# Altium schematic sheet EE3102_Project_2.SchDoc
size A; SheetNumber: 2; SheetTotal: 2
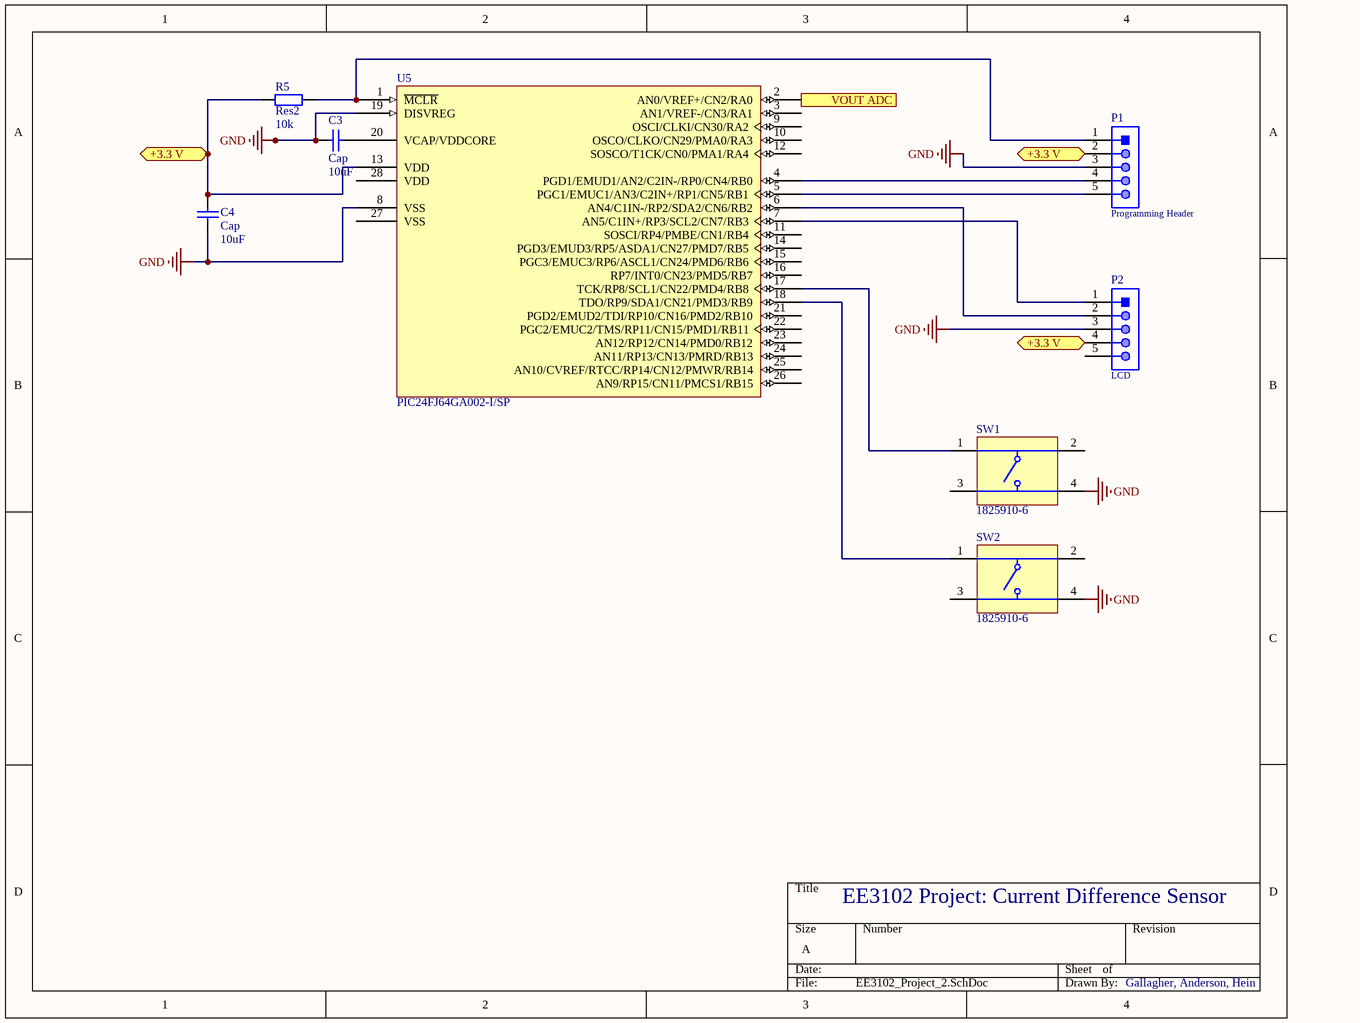
[diagram p0: EE3102_Project_2.SchDoc]

## Parts
C3  Cap  value 10uF  [RAD-0.3]
C4  Cap  value 10uF  [RAD-0.3]
P1  Programming Header  [61300511121]
P2  LCD  [LCD_5_Pin]
R5  Res2  value 10k  [AXIAL-0.4]
SW1  1825910-6  [TECO-1825910-6_V]
SW2  1825910-6  [TECO-1825910-6_V]
U5  PIC24FJ64GA002-I/SP  [SPDIP300-SP28]

## Ports
+3.3 V (bidir), VOUT ADC

## Nets
GND: C3.2 C4.2 P1.3(VSS) P2.3(GND) SW1.4 SW2.4 U5.8(VSS) U5.19(DISVREG)
+3.3 V: C4.1 P1.2(VDD) P2.4(SDA) R5.2 U5.13(VDD) ; port +3.3 V
VOUT ADC: U5.2(AN0/VREF+/CN2/RA0) ; port VOUT ADC
NetC3_1: C3.1 U5.20(VCAP/VDDCORE)
NetP1_1: P1.1(nmclr) R5.1 U5.1(~{MCLR})
NetP1_4: P1.4(PGD) U5.4(PGD1/EMUD1/AN2/C2IN-/RP0/CN4/RB0)
NetP1_5: P1.5(PGC) U5.5(PGC1/EMUC1/AN3/C2IN+/RP1/CN5/RB1)
NetP2_1: P2.1(XRST) U5.7(AN5/C1IN+/RP3/SCL2/CN7/RB3)
NetP2_2: P2.2(VDD) U5.6(AN4/C1IN-/RP2/SDA2/CN6/RB2)
NetSW1_1: SW1.1 U5.17(TCK/RP8/SCL1/CN22/PMD4/RB8)
NetSW2_1: SW2.1 U5.18(TDO/RP9/SDA1/CN21/PMD3/RB9)

Not connected (* = marked no-connect by the designer): P2 5(SCL); SW1 2 3; SW2 2 3; U5 3(AN1/VREF-/CN3/RA1) 9(OSCI/CLKI/CN30/RA2) 10(OSCO/CLKO/CN29/PMA0/RA3) 11(SOSCI/RP4/PMBE/CN1/RB4) 12(SOSCO/T1CK/CN0/PMA1/RA4) 14(PGD3/EMUD3/RP5/ASDA1/CN27/PMD7/RB5) 15(PGC3/EMUC3/RP6/ASCL1/CN24/PMD6/RB6) 16(RP7/INT0/CN23/PMD5/RB7) 21(PGD2/EMUD2/TDI/RP10/CN16/PMD2/RB10) 22(PGC2/EMUC2/TMS/RP11/CN15/PMD1/RB11) 23(AN12/RP12/CN14/PMD0/RB12) 24(AN11/RP13/CN13/PMRD/RB13) 25(AN10/CVREF/RTCC/RP14/CN12/PMWR/RB14) 26(AN9/RP15/CN11/PMCS1/RB15) 27(VSS) 28(VDD)

## Notes on the sheet
- EE3102 Project: Current Difference Sensor
- Gallagher, Anderson, Hein

## Library data of the parts
C3 C4 = Cap: Capacitor; Published: 8-Jun-2000; LatestRevisionDate: 17-Jul-2002; LatestRevisionNote: Re-released for DXP Platform.; PackageReference: RAD-0.3; Publisher: Altium Limited; PackageDescription: Radial Cap, Thru-Hole; 2 Leads; 0.3 in Pin Spacing
P1 = CMP-1502-01068-1: THT Vertical Pin Header WR-PHD, Pitch 2.54 mm, Single Row, 5 pins; Manufacturer: Wurth Elektronik; Pin Number: 5; Contact Resistance: 20mOhm; Working Voltage: 250VAC; Pitch: 2.54mm; Withstanding Voltage: 500VAC; Rated Current: 3A; Gender: Male; Datasheet URL: https://katalog.we-online.de/em/datasheet/6130xx11121.pdf; Orientation: Vertical; Mounting Technology: THT; Row Number: Single; Package Reference: 61300511121; Publisher: WurthElektronik; Part Number: 61300511121; Packaging: Bag; Manufacturer URL: http://www.we-online.de; Operating Temperature: -40to105degC
P2 = WE-CN-1P-M-R5: THT Vertical Pin Header WR-PHD, Pitch 2.54 mm, Single Row, 5 pins; Part Number: 61300511121; Manufacturer: Wurth Elektronik; Pin Number: 5; Contact Resistance: 20mOhm; Working Voltage: 250VAC; Pitch: 2.54mm; Withstanding Voltage: 500VAC; Rated Current: 3A; Gender: Male; Datasheet URL: https://katalog.we-online.de/em/datasheet/6130xx11121.pdf; Orientation: Vertical; Mounting Technology: THT; Row Number: Single; Package Reference: 61300511121; Publisher: WurthElektronik; Packaging: Bag; Manufacturer URL: http://www.we-online.de; Operating Temperature: -40to105degC
R5 = Res2: Resistor; Published: 8-Jun-2000; LatestRevisionDate: 17-Jul-2002; LatestRevisionNote: Re-released for DXP Platform.; PackageReference: AXIAL-0.4; Publisher: Altium Limited; PackageDescription: Axial Device, Thru-Hole; 2 Leads; 0.4 in Pin Spacing
SW1 SW2 = CMP-1684-00021-1: Tact Switch, SPST-NO, 0.05 A, -35 to 85 degC, 4-Pin THD, RoHS, Bulk; Manufacturer: TE Connectivity; Maximum Contact Resistance: 100mOhm; Mechanical Life: 100000Cycles; Bushing Type: Unthreaded; Switch Configuration: OFF(ON); Maximum DC Voltage Rating: 24V; Contact Rating @ Voltage: 0.05A@24VDC; Actuator Color: Black; Body Orientation: Straight; Function: MomentaryContact; Illumination: N/R; Actuator Style: RoundButton; Actuator Material: PolybutyleneTerephthalate; Dielectric Strength: 500VAC; Pole Throw Configuration: SPST; Actuator Length: 1.4mm; Product Weight: N/A; Contact Material: CopperAlloy; Housing Material: N/A; Terminal Type: PCPins; Minimum Insulation Resistance: 100MOhm; Package Description: 4-Pin Through Hole Device, Body 5.99 x 5.99 mm, Pitch 6.5 mm; Part No: 1825910-6; Package Reference: THD; Base Material: N/A; Manufacturer URL: http://www.te.com; Contact Plating: Silver; RoHS: Yes; Datasheet Version: Rev. C9; Electrical Life: 100000Cycles; Maximum AC Voltage Rating: N/A; Thread Size: N/R; Operating Temperature: -35to85C; Mounting: ThroughHole; Dimension: 5.99x5mm; Datasheet URL: http://www.te.com/commerce/DocumentDelivery/DDEController?Action=showdoc&DocId=Customer+Drawing%7F1825910%7FC9%7Fpdf%7FEnglish%7FENG_CD_1825910_C9.pdf%7F1825910-6; Family: 1825910; Seal Location: N/A; Seal Description: N/A; Packaging: N/A
U5 = CMP-0046-00003-2: General Purpose 16-Bit Flash Microcontroller, 64KB Flash, 8KB SRAM, 28-Pin SPDIP, Industrial Temperature; RevisionNote: Component URLs added.; ComponentLink2URL: http://www.microchip.com/stellent/groups/techpub_sg/documents/packagingspec/en012702.pdf; ComponentLink2Description: Packaging Specification; PackageDescription: 28-Lead Skinny Plastic Dual In-Line (SP) - 300 mil Body [SPDIP]; PackageReference: SPDIP300-SP28; DatasheetVersion: revD, Feb-2010; PackageVersion: revBB, Aug-2009; ComponentLink3Description: Microchip.com Home; ComponentLink3URL: http://www.microchip.com/; ComponentLink1Description: Datasheet; ComponentLink1URL: http://ww1.microchip.com/downloads/en/DeviceDoc/39881D.pdf